# Altium project PROC010B.PrjPcb (part 5 of 5)

## Sheet PROC010B_CAN Interface.SchDoc: CAN Interface
size 431 x 279 mm; Date: Not shown in title block; ApprovedBy: Not shown in title block; CheckedBy: Not shown in title block; Author: Not shown in title block; CompanyName: Not shown in title block; DrawnBy: Adrian Ozer; Engineer: Not shown in title block; Organization: Not shown in title block; Address1: Not shown in title block; Address2: Not shown in title block; Address3: Not shown in title block; Address4: Not shown in title block; DocumentNumber: 14; Revision: Use project parameter SCH_Rev; SheetNumber: 14; SheetTotal: 16; PageSetup: Record=PageOptions|CenterHorizontal=True|CenterVertical=True|PrintScale=1.00|XCorrection=1.00|YCorrection=1.00|PrintKind=0|BorderSize=5000000|LeftOffset=0|BottomOffset=0|Orientation=2|PaperLength=1000|PaperWidth=1000|Scale=100|PaperSource=15|PrintQuality=600|MediaType=1|DitherType=10|PaperKind=Letter|PrintScaleMode=1; CurrentTime: Not shown in title block; CurrentDate: Not shown in title block; Time: Not shown in title block; DocumentFullPathAndName: Not shown in title block; DocumentName: Not shown in title block; ModifiedDate: Not shown in title block; ImagePath: Not shown in title block
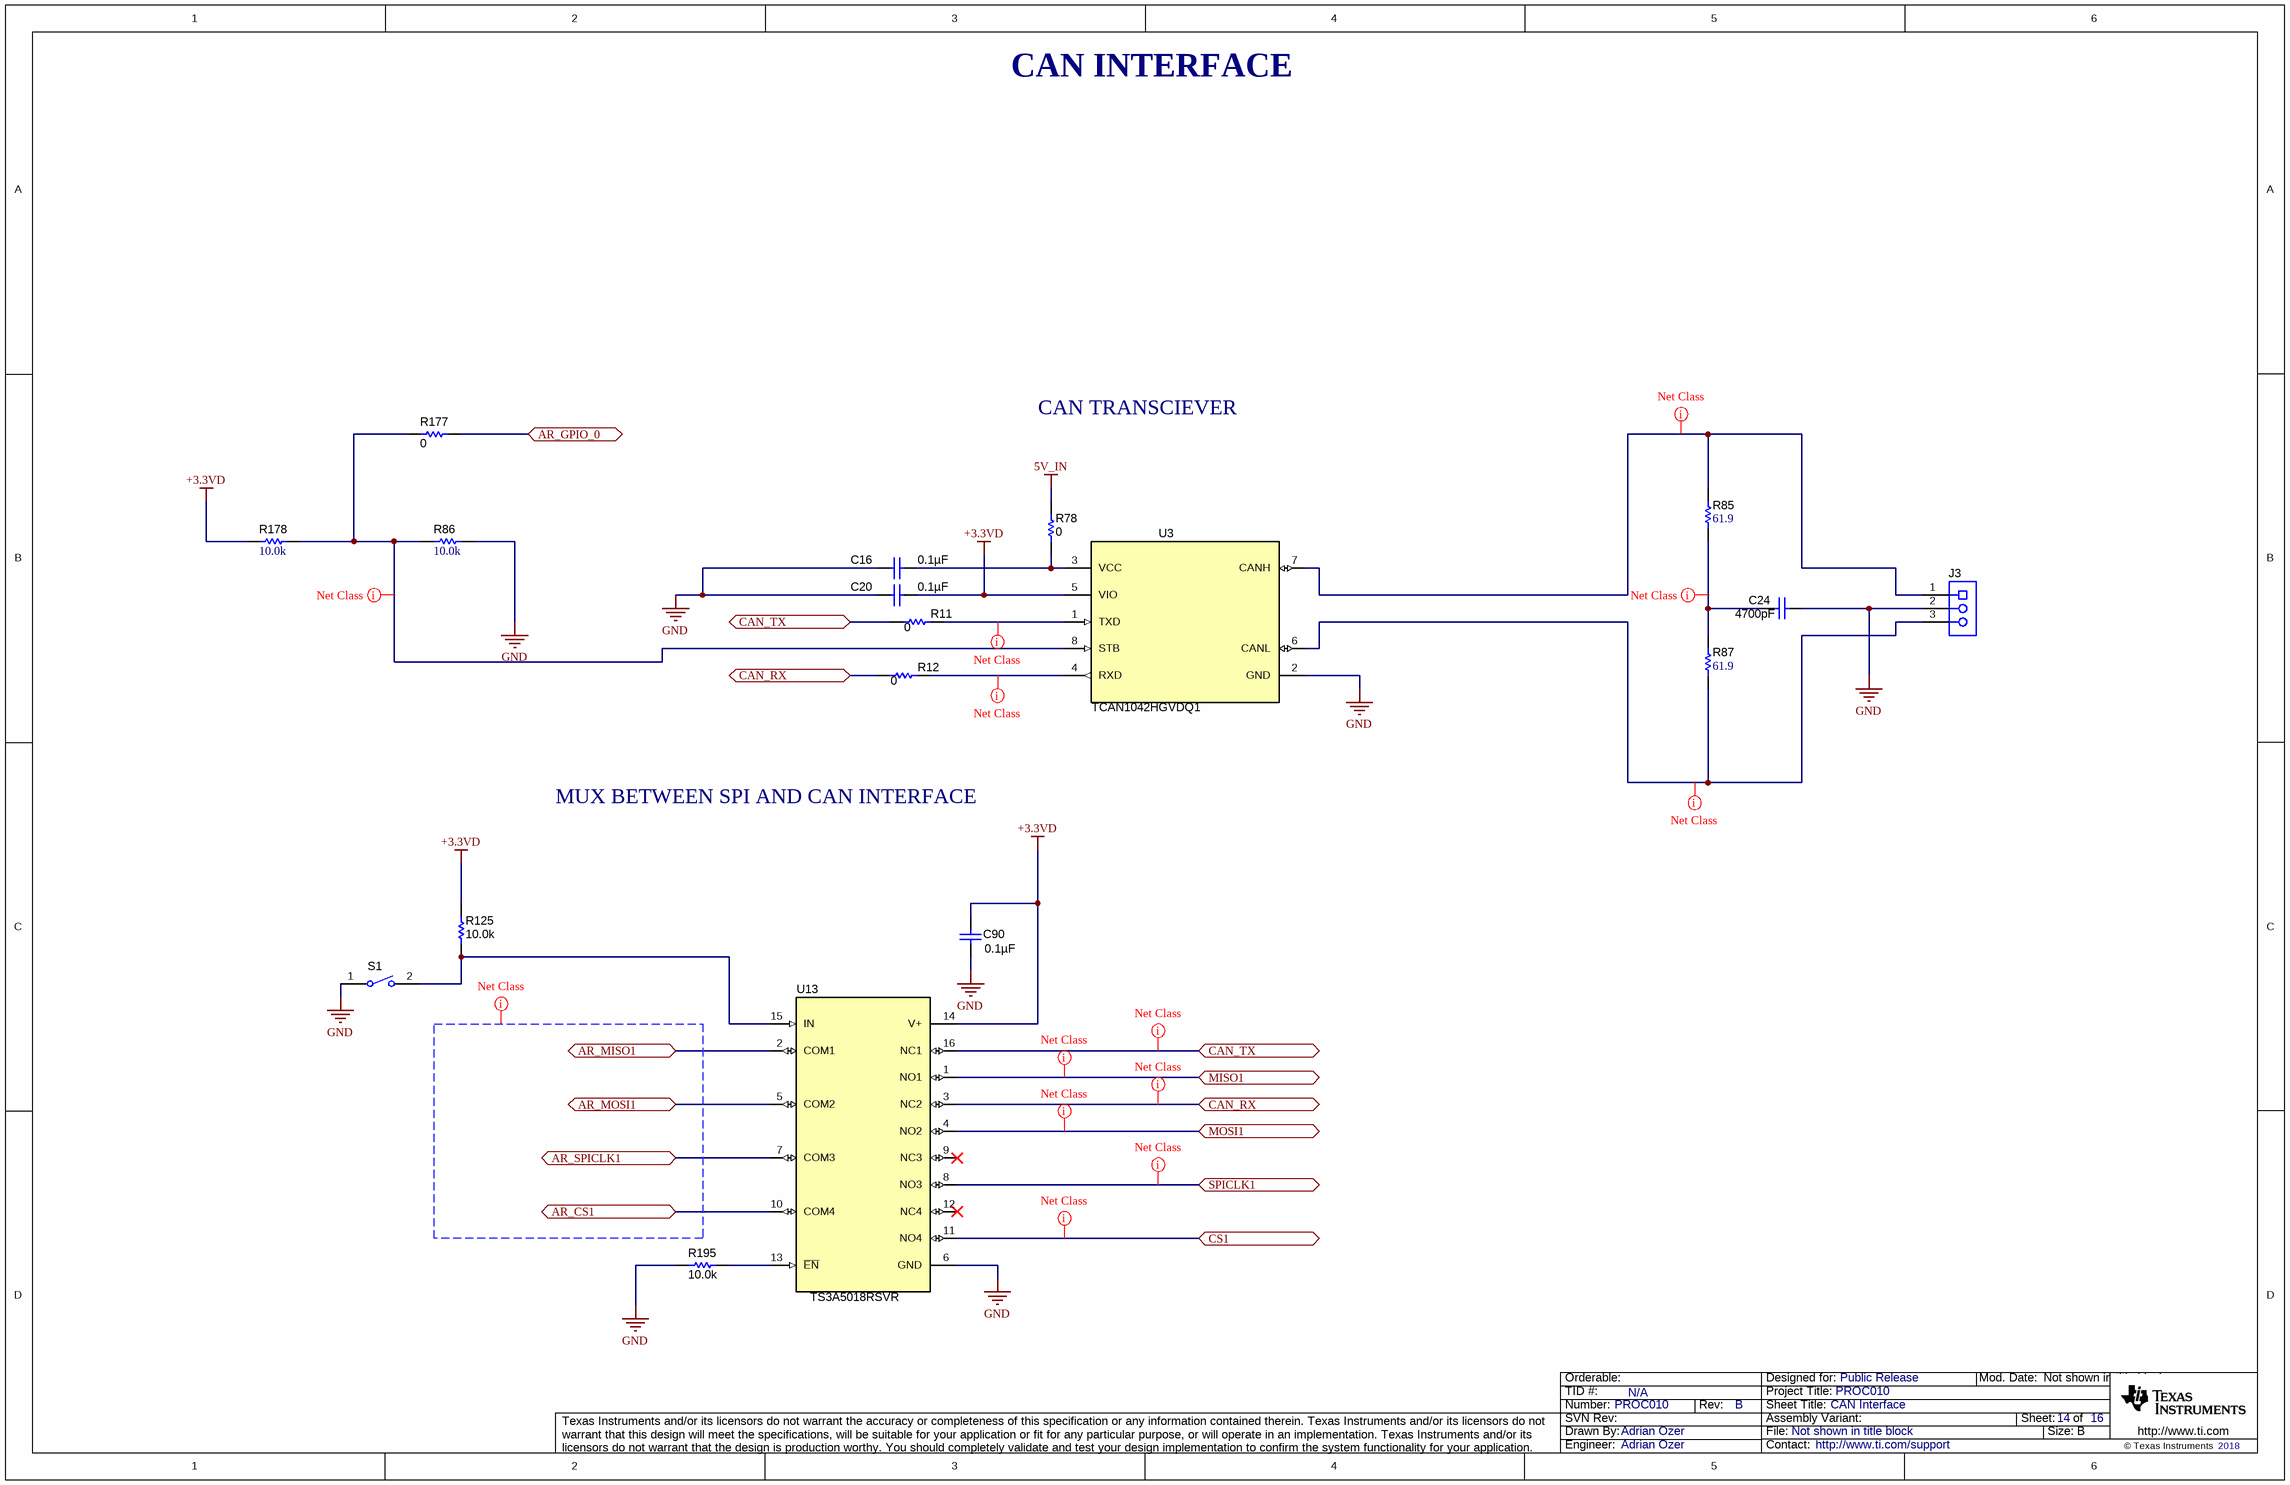
[diagram p13: PROC010B_CAN Interface.SchDoc]

### Parts
C16  ValueDisplayed: 0.1µF  [0402L]  (hidden comment: C0402C104K8RACTU)
C20  ValueDisplayed: 0.1µF  [0402L]  (hidden comment: C0402C104K8RACTU)
C24  ValueDisplayed: 4700pF  [0402L]  (hidden comment: C1005X7R1H472K050BA)
C90  ValueDisplayed: 0.1µF  [0402L]  (hidden comment: C0402C104K8RACTU)
J3  OSTTE030161  [On-Shore_OSTTE030161]  (value not drawn)
R11  ValueDisplayed: 0  [0402L]  (hidden comment: ERJ-2GE0R00X)
R12  ValueDisplayed: 0  [0402L]  (hidden comment: ERJ-2GE0R00X)
R78  ValueDisplayed: 0  [0402L]  (hidden comment: ERJ-2GE0R00X)
R85  ValueDisplayed: 61.9  [0402L]  (hidden comment: CRCW040261R9FKED)
R86  ValueDisplayed: 10.0k  [0402L]  (hidden comment: CRCW040210K0FKED)
R87  ValueDisplayed: 61.9  [0402L]  (hidden comment: CRCW040261R9FKED)
R125  ValueDisplayed: 10.0k  [0402L]  (hidden comment: CRCW040210K0FKED)
R177  ValueDisplayed: 0  [0402L]  (hidden comment: ERJ-2GE0R00X)
R178  ValueDisplayed: 10.0k  [0402L]  (hidden comment: CRCW040210K0FKED)
R195  ValueDisplayed: 10.0k  [0402L]  (hidden comment: CRCW040210K0FKED)
S1  CHS-01TB  [SW_CHS-01TB]  (value not drawn)
U3  TCAN1042HGVDQ1  [D0008A_L]
U13  TS3A5018RSVR  [RSV0016A]

### Ports
AR_CS1, AR_GPIO_0, AR_MISO1, AR_MOSI1, AR_SPICLK1, CAN_RX, CAN_TX, CS1, MISO1, MOSI1, SPICLK1

### Nets
5V_IN: R78.2
+3.3VD: C20.2 C90.2 R125.2 R178.1 U3.5(VIO) U13.14(V+)
GND: C16.1 C20.1 C24.1 C90.1 J3.2 R86.2 R195.2 S1.1 U3.2(GND) U13.6(GND)
AR_CS1: U13.10(COM4) ; port AR_CS1
AR_GPIO_0: R177.2 ; port AR_GPIO_0
AR_MISO1: U13.2(COM1) ; port AR_MISO1
AR_MOSI1: U13.5(COM2) ; port AR_MOSI1
AR_SPICLK1: U13.7(COM3) ; port AR_SPICLK1
CAN_RX: R12.1 U13.3(NC2) ; port CAN_RX
CAN_TX: R11.1 U13.16(NC1) ; port CAN_TX
CS1: U13.11(NO4) ; port CS1
MISO1: U13.1(NO1) ; port MISO1
MOSI1: U13.4(NO2) ; port MOSI1
SPICLK1: U13.8(NO3) ; port SPICLK1
NetC16_2: C16.2 R78.1 U3.3(VCC)
NetC24_2: C24.2 R85.1 R87.2
NetJ3_1: J3.1 R85.2 U3.7(CANH)
NetJ3_3: J3.3 R87.1 U3.6(CANL)
NetR11_2: R11.2 U3.1(TXD)
NetR12_2: R12.2 U3.4(RXD)
NetR86_1: R86.1 R177.1 R178.2 U3.8(STB)
NetR125_1: R125.1 S1.2 U13.15(IN)
NetR195_1: R195.1 U13.13(~{EN})

Not connected (* = marked no-connect by the designer): U13 9(NC3)* 12(NC4)*

### Layout directives
net class CAN: CAN_RX, CAN_TX, NetC24_2, NetJ3_1, NetJ3_3, NetR11_2, NetR12_2
net class GENERAL: NetR86_1
net class SPI: (no net found under the mark), CS1, MISO1, MOSI1, SPICLK1

### Notes on the sheet
- CAN INTERFACE
- CAN TRANSCIEVER
- MUX BETWEEN SPI AND CAN INTERFACE
- Drawn By:
- SVN Rev:
- Number:
- TID #:
- Orderable:
- Rev:
- Sheet Title:
- File:
- Project Title:
- Designed for:
- Assembly Variant:
- Mod. Date:
- Sheet:
- Size:
- of
- B
- http://www.ti.com
- Texas Instruments and/or its licensors do not warrant the accuracy or completeness of this specification or any information contained therein. Texas Instruments and/or its licensors do not warrant that this design will meet the specifications, will be suitable for your application or fit for any particular purpose, or will operate in an implementation. Texas Instruments and/or its licensors do not warrant that the design is production worthy. You should completely validate and test your design implementation to confirm the system functionality for your application.
- Engineer:
- Contact:
- © Texas Instruments

### Library data of the parts
C16 C20 C90 = CMP-0078241-1: CAP, CERM, 0.1 µF, 10 V,+/- 10%, X7R, 0402; Manufacturer: Kemet; TaMin_C: -55°C; Polarized: N; SizeAreaWB_mm2: 3; U/M: EA; Value: 0.1uF; TaMax_C: 125°C; SizeZ_mm: 0.6; SizeX_mm: 1; SizeY_mm: 0.5; Cap_Case: 0402; Value2: 10V; Cap_F: 100nF; AEC Category: Q200; ComponentLink1URL: https://content.kemet.com/datasheets/KEM_C1002_X7R_SMD.pdf; Supplier Part Number 2: 68X2393; Supplier 2: Newark; Supplier Part Number 3: 80-C0402C104K8R; TempCo: X7R; Supplier 3: Mouser; RoHS: Y; MountType: SMT; Supplier 1: Digi-Key; PackageReference: 0402; Tolerance_%: 10%; SizeArea_mm2: 0.5; CompType: Capacitor; PartNumber: C0402C104K8RACTU; AEC Qualified: N; VDC_V: 10V; ComponentLink1Description: Datasheet link; AEC Grade: N/A; Supplier Part Number 1: 399-3520-1-ND; Technology: Ceramic
C24 = CMP-0078221-1: CAP, CERM, 4700 pF, 50 V,+/- 10%, X7R, 0402; Manufacturer: TDK; TaMin_C: -55°C; Polarized: N; SizeAreaWB_mm2: 3; U/M: EA; Value: 4700pF; TaMax_C: 125°C; SizeZ_mm: 0.6; SizeX_mm: 1; SizeY_mm: 0.5; Cap_Case: 0402; Value2: 50V; Cap_F: 4.7nF; AEC Category: Q200; ComponentLink1URL: https://product.tdk.com/info/en/catalog/datasheets/mlcc_commercial_general_en.pdf; Supplier Part Number 2: 55T0075; Supplier 2: Newark; Supplier Part Number 3: 810-C1005X7R1H472K; TempCo: X7R; Supplier 3: Mouser; RoHS: Y; MountType: SMT; Supplier 1: Digi-Key; PackageReference: 0402; Tolerance_%: 10%; SizeArea_mm2: 0.5; CompType: Capacitor; PartNumber: C1005X7R1H472K050BA; AEC Qualified: N; VDC_V: 50V; ComponentLink1Description: Datasheet link; AEC Grade: N/A; Supplier Part Number 1: 445-1258-1-ND; Technology: Ceramic
J3 = CMP-0075352-1: Terminal Block, 3.5mm, 3x1, Tin, R/A, TH; Manufacturer: On-Shore Technology; CNHeader: False; Current_A: 10A; Green_Lifecycle: Not Set; Gender: Female; Cert_CSA: Y; Green_REACh: Incomplete; Voltage_V: 125V; Row_Count: 1; Pitch_mm: 3.5; CT: True; ComponentLink1URL: http://www.on-shore.com/wp-content/uploads/2015/09/osttexx0161.pdf; Publisher: Texas Instruments; Color: Blue; RoHS: Y; MountType: TH; Green_EU RoHS-2: Incomplete; Supplier 1: Digi-Key; Green_EU RoHS: Incomplete; PackageReference: Terminal Block, 3.5mm, 3x1, TH; PinCount: 3; CompType: Terminal Block; LatestRevisionDate: 2017-07-12; PartNumber: OSTTE030161; Orientation: R/A; ComponentLink1Description: Datasheet URL; Supplier Part Number 1: ED2636-ND; ContactFinish: Tin; Cert_UL: Y
R11 R12 R177 = CMP-0026992-2: RES, 0, 5%, 0.063 W, 0402; Manufacturer: Panasonic; Power_W: 63mW; TempCo: 600 ppm/C; Value_Code: 0000; U/M: EA; Value: 0; EIA_Code: E24; SizeX_mm: 1; SizeY_mm: 0.5; SizeZ_mm: 0.6; Value2: 0.063W; CompType: Resistor; VDC_V: 50V; AEC Category: Q200; INSTALATION: DNP; Supplier Part Number 2: 65T8307; Publisher: Texas Instruments; Supplier 2: Newark; Supplier Part Number 3: 667-ERJ-2GE0R00X; Supplier 3: Mouser; Published: 2008-06-26; RoHS: Y; Value1: 5%; MountType: SMT; Supplier 1: Digi-Key; PackageReference: 0402; Tolerance_%: 5%; Res_ohm: 0; SizeArea_mm2: 0.5; LatestRevisionDate: 2017-03-09; PartNumber: ERJ-2GE0R00X; AEC Qualified: ?; ComponentLink1Description: Datasheet link; Supplier Part Number 1: P0.0JCT-ND; Technology: Thick Film; ComponentLink1URL: http://www.panasonic.com/industrial/components/pdf/AOA0000CE1.pdf
R78 = CMP-0026992-2: RES, 0, 5%, 0.063 W, 0402; Manufacturer: Panasonic; Power_W: 63mW; TempCo: 600 ppm/C; Value_Code: 0000; U/M: EA; Value: 0; EIA_Code: E24; SizeX_mm: 1; SizeY_mm: 0.5; SizeZ_mm: 0.6; Value2: 0.063W; CompType: Resistor; VDC_V: 50V; AEC Category: Q200; Supplier Part Number 2: 65T8307; Publisher: Texas Instruments; Supplier 2: Newark; Supplier Part Number 3: 667-ERJ-2GE0R00X; Supplier 3: Mouser; Published: 2008-06-26; RoHS: Y; Value1: 5%; MountType: SMT; Supplier 1: Digi-Key; PackageReference: 0402; Tolerance_%: 5%; Res_ohm: 0; SizeArea_mm2: 0.5; LatestRevisionDate: 2017-03-09; PartNumber: ERJ-2GE0R00X; AEC Qualified: ?; ComponentLink1Description: Datasheet link; Supplier Part Number 1: P0.0JCT-ND; Technology: Thick Film; ComponentLink1URL: http://www.panasonic.com/industrial/components/pdf/AOA0000CE1.pdf
R85 R87 = CMP-0026491-2: RES, 61.9, 1%, 0.063 W, AEC-Q200 Grade 0, 0402; Manufacturer: Vishay-Dale; Power_W: 63mW; TempCo: 100 ppm/C; Value_Code: 61R9; Value: 61.9; EIA_Code: E96; SizeX_mm: 1; SizeY_mm: 0.5; SizeZ_mm: 0.6; Value2: 0.063W; AEC Qualified: Y; VDC_V: 50V; AEC Category: Q200; AEC Grade: 0; ComponentLink1URL: http://www.vishay.com/docs/20035/dcrcwe3.pdf; Supplier Part Number 2: 52K7198; Supplier 2: Newark; Supplier Part Number 3: 71-CRCW0402-61.9-E3; Supplier 3: Mouser; RoHS: E; Value1: 1%; MountType: SMT; Supplier 1: Digi-Key; PackageReference: 0402; Tolerance_%: 1%; Res_ohm: 61.9; SizeArea_mm2: 0.5; CompType: Resistor; PartNumber: CRCW040261R9FKED; ComponentLink1Description: Datasheet link; Supplier Part Number 1: 541-61.9LCT-ND; Technology: Thick Film
R86 R178 = CMP-0025958-3: RES, 10.0 k, 1%, 0.063 W, AEC-Q200 Grade 0, 0402; Manufacturer: Vishay-Dale; Power_W: 63mW; TempCo: 100 ppm/C; Value_Code: 10k0; Value: 10.0k; EIA_Code: E96; Res_ohm: 10k; SizeX_mm: 1; SizeY_mm: 0.5; SizeZ_mm: 0.6; Value2: 0.063W; AEC Qualified: Y; VDC_V: 50V; AEC Category: Q200; AEC Grade: 0; Supplier Part Number 2: 52K6595; Supplier 2: Newark; Supplier Part Number 3: 71-CRCW0402-10K-E3; Supplier 3: Mouser; RoHS: E; Value1: 1%; MountType: SMT; Supplier 1: Digi-Key; PackageReference: 0402; Tolerance_%: 1%; SizeArea_mm2: 0.5; CompType: Resistor; PartNumber: CRCW040210K0FKED; ComponentLink1Description: Datasheet link; Supplier Part Number 1: 541-10.0KLCT-ND; Technology: Thick Film; ComponentLink1URL: http://www.vishay.com/docs/20035/dcrcwe3.pdf
R125 R195 = CMP-0025958-2: RES, 10.0 k, 1%, 0.063 W, 0402; Manufacturer: Vishay-Dale; Power_W: 63mW; TempCo: 100 ppm/C; Value_Code: 10k0; U/M: EA; Value: 10.0k; EIA_Code: E96; Res_ohm: 10k; SizeX_mm: 1; SizeY_mm: 0.5; SizeZ_mm: 0.6; Value2: 0.063W; CompType: Resistor; VDC_V: 50V; AEC Category: Q200; Supplier Part Number 2: 52K6595; Publisher: Texas Instruments; Supplier 2: Newark; Supplier Part Number 3: 71-CRCW0402-10K-E3; Supplier 3: Mouser; Published: 2008-06-26; RoHS: Y; Value1: 1%; MountType: SMT; Supplier 1: Digi-Key; PackageReference: 0402; Tolerance_%: 1%; SizeArea_mm2: 0.5; LatestRevisionDate: 2017-03-09; PartNumber: CRCW040210K0FKED; AEC Qualified: ?; ComponentLink1Description: Datasheet link; Supplier Part Number 1: 541-10.0KLCT-ND; Technology: Thick Film; ComponentLink1URL: http://www.vishay.com/docs/20035/dcrcwe3.pdf
S1 = CMP-0002163-2: Switch, Slide, SPST, Top Slide, SMT; Manufacturer: Copal Electronics; CurrentRating_mA: 100A; SwitchFunction: Off-On; VDC_V: 6V; PositionCount: 1; ComponentLink1Description: Datasheet URL; LatestRevisionDate: 2017-03-09; PackageReference: Switch, Single Top Slide, 2.5x8x2.5mm; Publisher: Texas Instruments; Supplier 1: Digi-Key; Supplier Part Number 1: 563-1004-1-ND; MountType: SMT; Circuit: SPST; Orientation: Top Actuated; PartNumber: CHS-01TB; CompType: Switch; RoHS: Y; ComponentLink1URL: http://copal-electronics.info/en/CopalElectronics/switches_en/chs_en.pdf
U3 = CMP-0075992-1: Automotive Fault Protected CAN Transceiver With Flexible Data-Rate, D0008A (SOIC-8); Manufacturer: Texas Instruments; Alternate PartNumber: TCAN1042HGVDRQ1; SizeAreaWB_mm2: 56.58; SizeArea_mm2: 30.38; SizeZ_mm: 1.75; SizeY_mm: 6.2; U/M: EA; CompType: IC; SizeX_mm: 4.9; ComponentLink1Description: Datasheet Link; RoHS: Y; PackageReference: D0008A; PartNumber: TCAN1042HGVDQ1; Publisher: Texas Instruments; PackageDescription: SOIC-8; Alternate Manufacturer: Texas Instruments; ComponentLink1URL: http://www.ti.com/lit/ds/symlink/tcan1042-q1.pdf; LatestRevisionDate: 2017-06-09; MountType: SMT
U13 = CMP-0067415-1: 10-Ohm Quad SPDT Analog Switch, RSV0016A (UQFN-16); Alternate Manufacturer: Texas Instruments; SizeAreaWB_mm2: 10.08; U/M: EA; SizeZ_mm: 0.55; SizeX_mm: 1.8; SizeY_mm: 2.6; SizeArea_mm2: 4.68; CompType: IC; ComponentLink1URL: http://www.ti.com/lit/ds/symlink/ts3a5018.pdf; Publisher: Texas Instruments; PackageDescription: UQFN-16; RoHS: Y; Footprint Path 6: C:\AltiumLibraries\Footprints\TI\.PcbLib; MountType: SMT; Manufacturer: Texas Instruments; PackageReference: RSV0016A; LatestRevisionDate: 2017-06-09; PartNumber: TS3A5018RSVR; ComponentLink1Description: Datasheet Link

## Sheet PROC010B_Tempsensor.SchDoc: Tempsensor
size 431 x 279 mm; Date: Not shown in title block; ApprovedBy: Not shown in title block; CheckedBy: Not shown in title block; Author: Not shown in title block; CompanyName: Not shown in title block; DrawnBy: Adrian Ozer; Engineer: Not shown in title block; Organization: Not shown in title block; Address1: Not shown in title block; Address2: Not shown in title block; Address3: Not shown in title block; Address4: Not shown in title block; DocumentNumber: 15; Revision: Use project parameter SCH_Rev; SheetNumber: 15; SheetTotal: 16; PageSetup: Record=PageOptions|CenterHorizontal=True|CenterVertical=True|PrintScale=1.00|XCorrection=1.00|YCorrection=1.00|PrintKind=0|BorderSize=5000000|LeftOffset=0|BottomOffset=0|Orientation=2|PaperLength=1000|PaperWidth=1000|Scale=100|PaperSource=15|PrintQuality=600|MediaType=1|DitherType=10|PaperKind=Letter|PrintScaleMode=1; CurrentTime: Not shown in title block; CurrentDate: Not shown in title block; Time: Not shown in title block; DocumentFullPathAndName: Not shown in title block; DocumentName: Not shown in title block; ModifiedDate: Not shown in title block; ImagePath: Not shown in title block
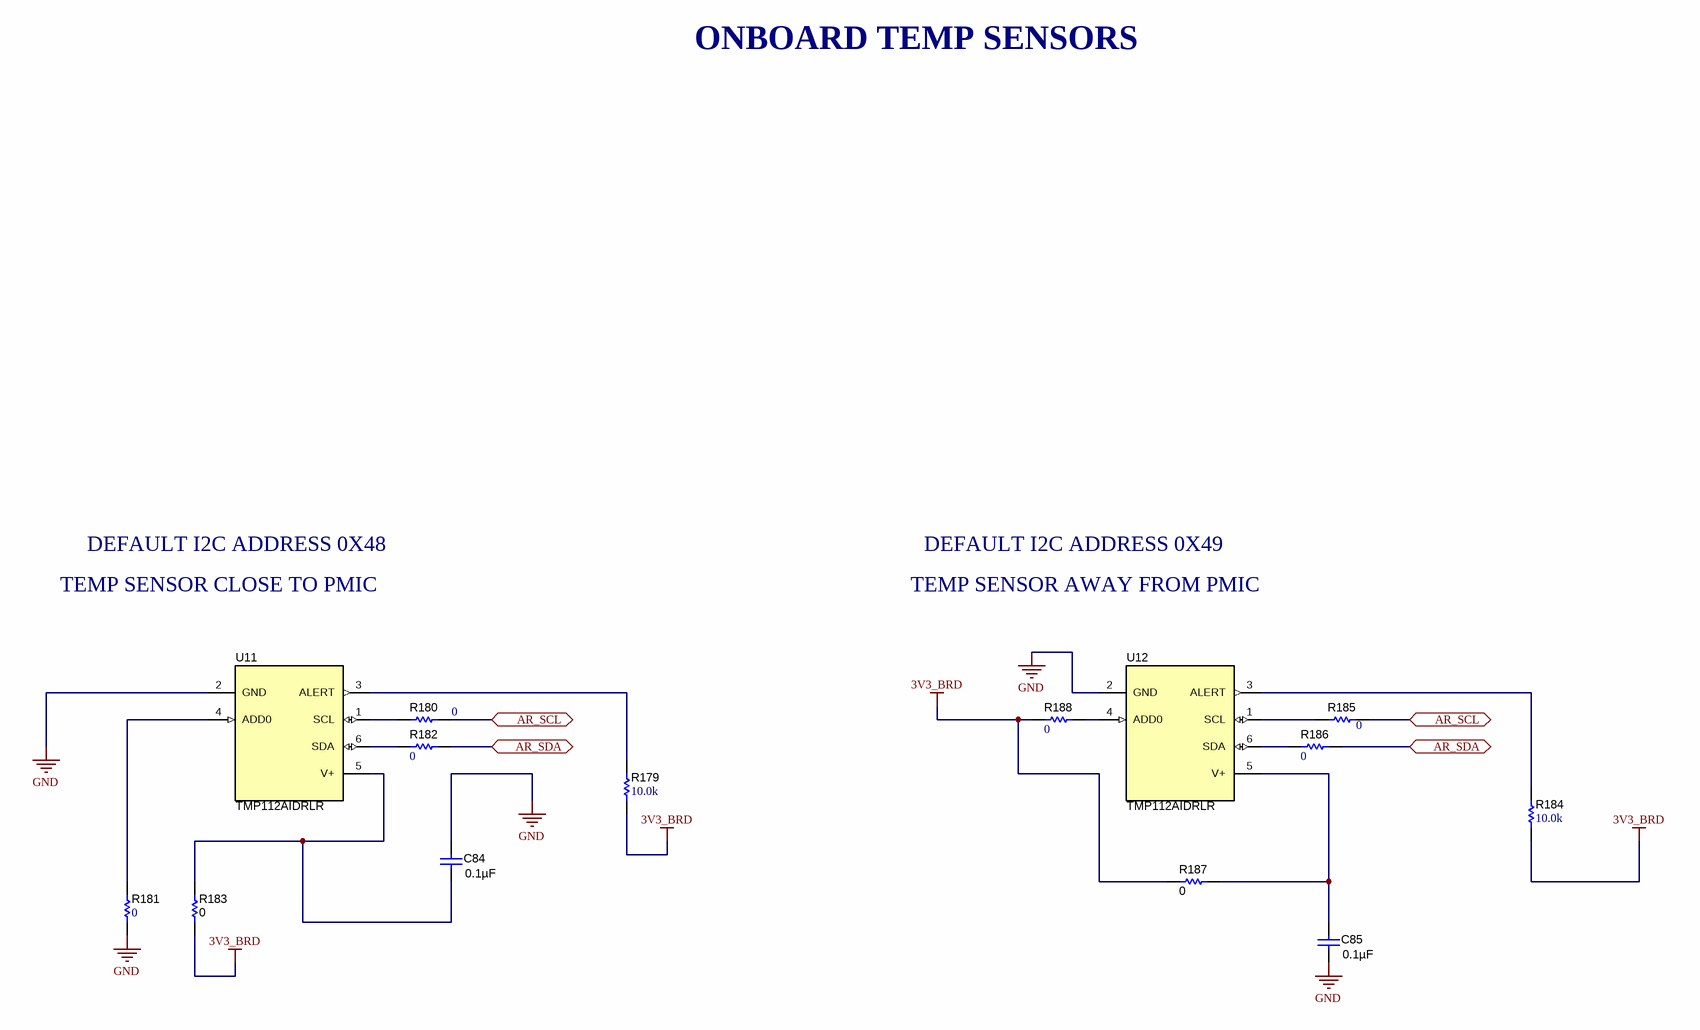
[diagram p14: PROC010B_Tempsensor.SchDoc]

### Parts
C84  ValueDisplayed: 0.1µF  [0402L]  (hidden comment: C0402C104K8RACTU)
C85  ValueDisplayed: 0.1µF  [0402L]  (hidden comment: C0402C104K8RACTU)
R179  ValueDisplayed: 10.0k  [0402L]  (hidden comment: CRCW040210K0FKED)
R180  ValueDisplayed: 0  [0201_Silk]  (hidden comment: CRCW02010000Z0ED)
R181  ValueDisplayed: 0  [0201_Silk]  (hidden comment: CRCW02010000Z0ED)
R182  ValueDisplayed: 0  [0201_Silk]  (hidden comment: CRCW02010000Z0ED)
R183  ValueDisplayed: 0  [0402L]  (hidden comment: ERJ-2GE0R00X)
R184  ValueDisplayed: 10.0k  [0402L]  (hidden comment: CRCW040210K0FKED)
R185  ValueDisplayed: 0  [0201_Silk]  (hidden comment: CRCW02010000Z0ED)
R186  ValueDisplayed: 0  [0201_Silk]  (hidden comment: CRCW02010000Z0ED)
R187  ValueDisplayed: 0  [0402L]  (hidden comment: ERJ-2GE0R00X)
R188  ValueDisplayed: 0  [0201_Silk]  (hidden comment: CRCW02010000Z0ED)
U11  TMP112AIDRLR  [DRL0006A]
U12  TMP112AIDRLR  [DRL0006A]

### Ports
AR_SCL, AR_SDA

### Nets
3V3_BRD: R179.2 R183.2 R184.2 R187.2 R188.1
GND: C84.1 C85.2 R181.2 U11.2(GND) U12.2(GND)
AR_SCL: R180.1 R185.1 ; port AR_SCL
AR_SDA: R182.2 R186.2 ; port AR_SDA
NetC84_2: C84.2 R183.1 U11.5(V+)
NetC85_1: C85.1 R187.1 U12.5(V+)
NetR179_1: R179.1 U11.3(ALERT)
NetR180_2: R180.2 U11.1(SCL)
NetR181_1: R181.1 U11.4(ADD0)
NetR182_1: R182.1 U11.6(SDA)
NetR184_1: R184.1 U12.3(ALERT)
NetR185_2: R185.2 U12.1(SCL)
NetR186_1: R186.1 U12.6(SDA)
NetR188_2: R188.2 U12.4(ADD0)

### Notes on the sheet
- ONBOARD TEMP SENSORS
- TEMP SENSOR CLOSE TO PMIC
- DEFAULT I2C ADDRESS 0X48
- TEMP SENSOR AWAY FROM PMIC
- DEFAULT I2C ADDRESS 0X49
- Drawn By:
- SVN Rev:
- Number:
- TID #:
- Orderable:
- Rev:
- Sheet Title:
- File:
- Project Title:
- Designed for:
- Assembly Variant:
- Mod. Date:
- Sheet:
- Size:
- of
- B
- http://www.ti.com
- Texas Instruments and/or its licensors do not warrant the accuracy or completeness of this specification or any information contained therein. Texas Instruments and/or its licensors do not warrant that this design will meet the specifications, will be suitable for your application or fit for any particular purpose, or will operate in an implementation. Texas Instruments and/or its licensors do not warrant that the design is production worthy. You should completely validate and test your design implementation to confirm the system functionality for your application.
- Engineer:
- Contact:
- © Texas Instruments

### Library data of the parts
C84 C85 = CMP-0078241-1: as C16 on sheet PROC010B_CAN Interface; ComponentLink1URL: https://content.kemet.com/datasheets/KEM_C1002_X7R_SMD.pdf; Supplier Part Number 2: 68X2393; Supplier 2: Newark; Supplier Part Number 3: 80-C0402C104K8R; TempCo: X7R; Supplier 3: Mouser; RoHS: Y; MountType: SMT; Supplier 1: Digi-Key; PackageReference: 0402; Tolerance_%: 10%; SizeArea_mm2: 0.5; CompType: Capacitor; PartNumber: C0402C104K8RACTU; AEC Qualified: N; VDC_V: 10V; ComponentLink1Description: Datasheet link; AEC Grade: N/A; Supplier Part Number 1: 399-3520-1-ND; Technology: Ceramic
R179 R184 = CMP-0025958-3: as R86 on sheet PROC010B_CAN Interface; Supplier Part Number 2: 52K6595; Supplier 2: Newark; Supplier Part Number 3: 71-CRCW0402-10K-E3; Supplier 3: Mouser; RoHS: E; Value1: 1%; MountType: SMT; Supplier 1: Digi-Key; PackageReference: 0402; Tolerance_%: 1%; SizeArea_mm2: 0.5; CompType: Resistor; PartNumber: CRCW040210K0FKED; ComponentLink1Description: Datasheet link; Supplier Part Number 1: 541-10.0KLCT-ND; Technology: Thick Film; ComponentLink1URL: http://www.vishay.com/docs/20035/dcrcwe3.pdf
R180-R182 R185 R186 R188 = CMP-0027008-4: RES, 0, 5%, 0.05 W, 0201; Manufacturer: Vishay-Dale; Power_W: 50mW; TempCo: ppm/C; Value_Code: 0000; Value: 0; EIA_Code: E24; SizeX_mm: 0.6; SizeY_mm: 0.3; SizeZ_mm: 0.26; Value2: 0.05W; SizeArea_mm2: 0.18; AEC Qualified: N; AEC Category: Q200; RoHS: E; Value1: 5%; MountType: SMT; Supplier 1: Newark; PackageReference: 0201; Tolerance_%: 5%; Res_ohm: 0; CompType: Resistor; PartNumber: CRCW02010000Z0ED; ComponentLink1Description: Datasheet link; AEC Grade: N/A; Supplier Part Number 1: 72M6743; Technology: Thick Film; ComponentLink1URL: http://www.vishay.com/docs/20052/crcw0201e3.pdf
R183 R187 = CMP-0026992-2: RES, 0, 5%, 0.063 W, 0402; Manufacturer: Panasonic; Power_W: 63mW; TempCo: 600 ppm/C; Value_Code: 0000; U/M: EA; Value: 0; EIA_Code: E24; SizeX_mm: 1; SizeY_mm: 0.5; SizeZ_mm: 0.6; Value2: 0.063W; VDC_V: 50V; AEC Category: Q200; Supplier Part Number 2: 65T8307; Publisher: Texas Instruments; Supplier 2: Newark; Supplier Part Number 3: 667-ERJ-2GE0R00X; Supplier 3: Mouser; Published: 2008-06-26; RoHS: Y; Value1: 5%; MountType: SMT; Supplier 1: Digi-Key; PackageReference: 0402; Tolerance_%: 5%; Res_ohm: 0; SizeArea_mm2: 0.5; CompType: Resistor; LatestRevisionDate: 2017-03-09; PartNumber: ERJ-2GE0R00X; AEC Qualified: ?; ComponentLink1Description: Datasheet link; Supplier Part Number 1: P0.0JCT-ND; Technology: Thick Film; ComponentLink1URL: http://www.panasonic.com/industrial/components/pdf/AOA0000CE1.pdf
U11 U12 = CMP-0067397-2: 1.4V-Capable +/-0.5degC Temperature Sensor with Alert Function and I2C/SMBus interface in SOT-563, DRL0006A (SOT-OTHER-6); Alternate PartNumber: TMP112AIDRLT; Alternate Manufacturer: Texas Instruments; Green_Lifecycle: Active; SizeAreaWB_mm2: 6.76; Green_REACh: Passed; U/M: EA; SizeZ_mm: 0.6; SizeX_mm: 1.6; SizeArea_mm2: 2.56; CompType: IC; ComponentLink1URL: http://www.ti.com/lit/ds/symlink/tmp112.pdf; Publisher: Texas Instruments; PackageDescription: SOT-OTHER-6; RoHS: Y; MountType: SMT; Green_EU RoHS-2: Passed; Manufacturer: Texas Instruments; Green_EU RoHS: Passed; PackageReference: DRL0006A; SizeY_mm: 1.6; LatestRevisionDate: 2017-06-09; PartNumber: TMP112AIDRLR; ComponentLink1Description: Datasheet Link

## Sheet PROC010B_Hardware.SchDoc: Hardware
size 431 x 279 mm; Date: Not shown in title block; ApprovedBy: Not shown in title block; CheckedBy: Not shown in title block; Author: Not shown in title block; CompanyName: Not shown in title block; DrawnBy: Adrian Ozer; Engineer: Not shown in title block; Organization: Not shown in title block; Address1: Not shown in title block; Address2: Not shown in title block; Address3: Not shown in title block; Address4: Not shown in title block; DocumentNumber: 16; Revision: Use project parameter SCH_Rev; SheetNumber: 16; SheetTotal: 16; PageSetup: Record=PageOptions|CenterHorizontal=True|CenterVertical=True|PrintScale=1.00|XCorrection=1.00|YCorrection=1.00|PrintKind=0|BorderSize=5000000|LeftOffset=0|BottomOffset=0|Orientation=2|PaperLength=1000|PaperWidth=1000|Scale=100|PaperSource=15|PrintQuality=600|MediaType=1|DitherType=10|PaperKind=Letter|PrintScaleMode=1; CurrentTime: Not shown in title block; CurrentDate: Not shown in title block; Time: Not shown in title block; DocumentFullPathAndName: Not shown in title block; DocumentName: Not shown in title block; ModifiedDate: Not shown in title block; ImagePath: Not shown in title block
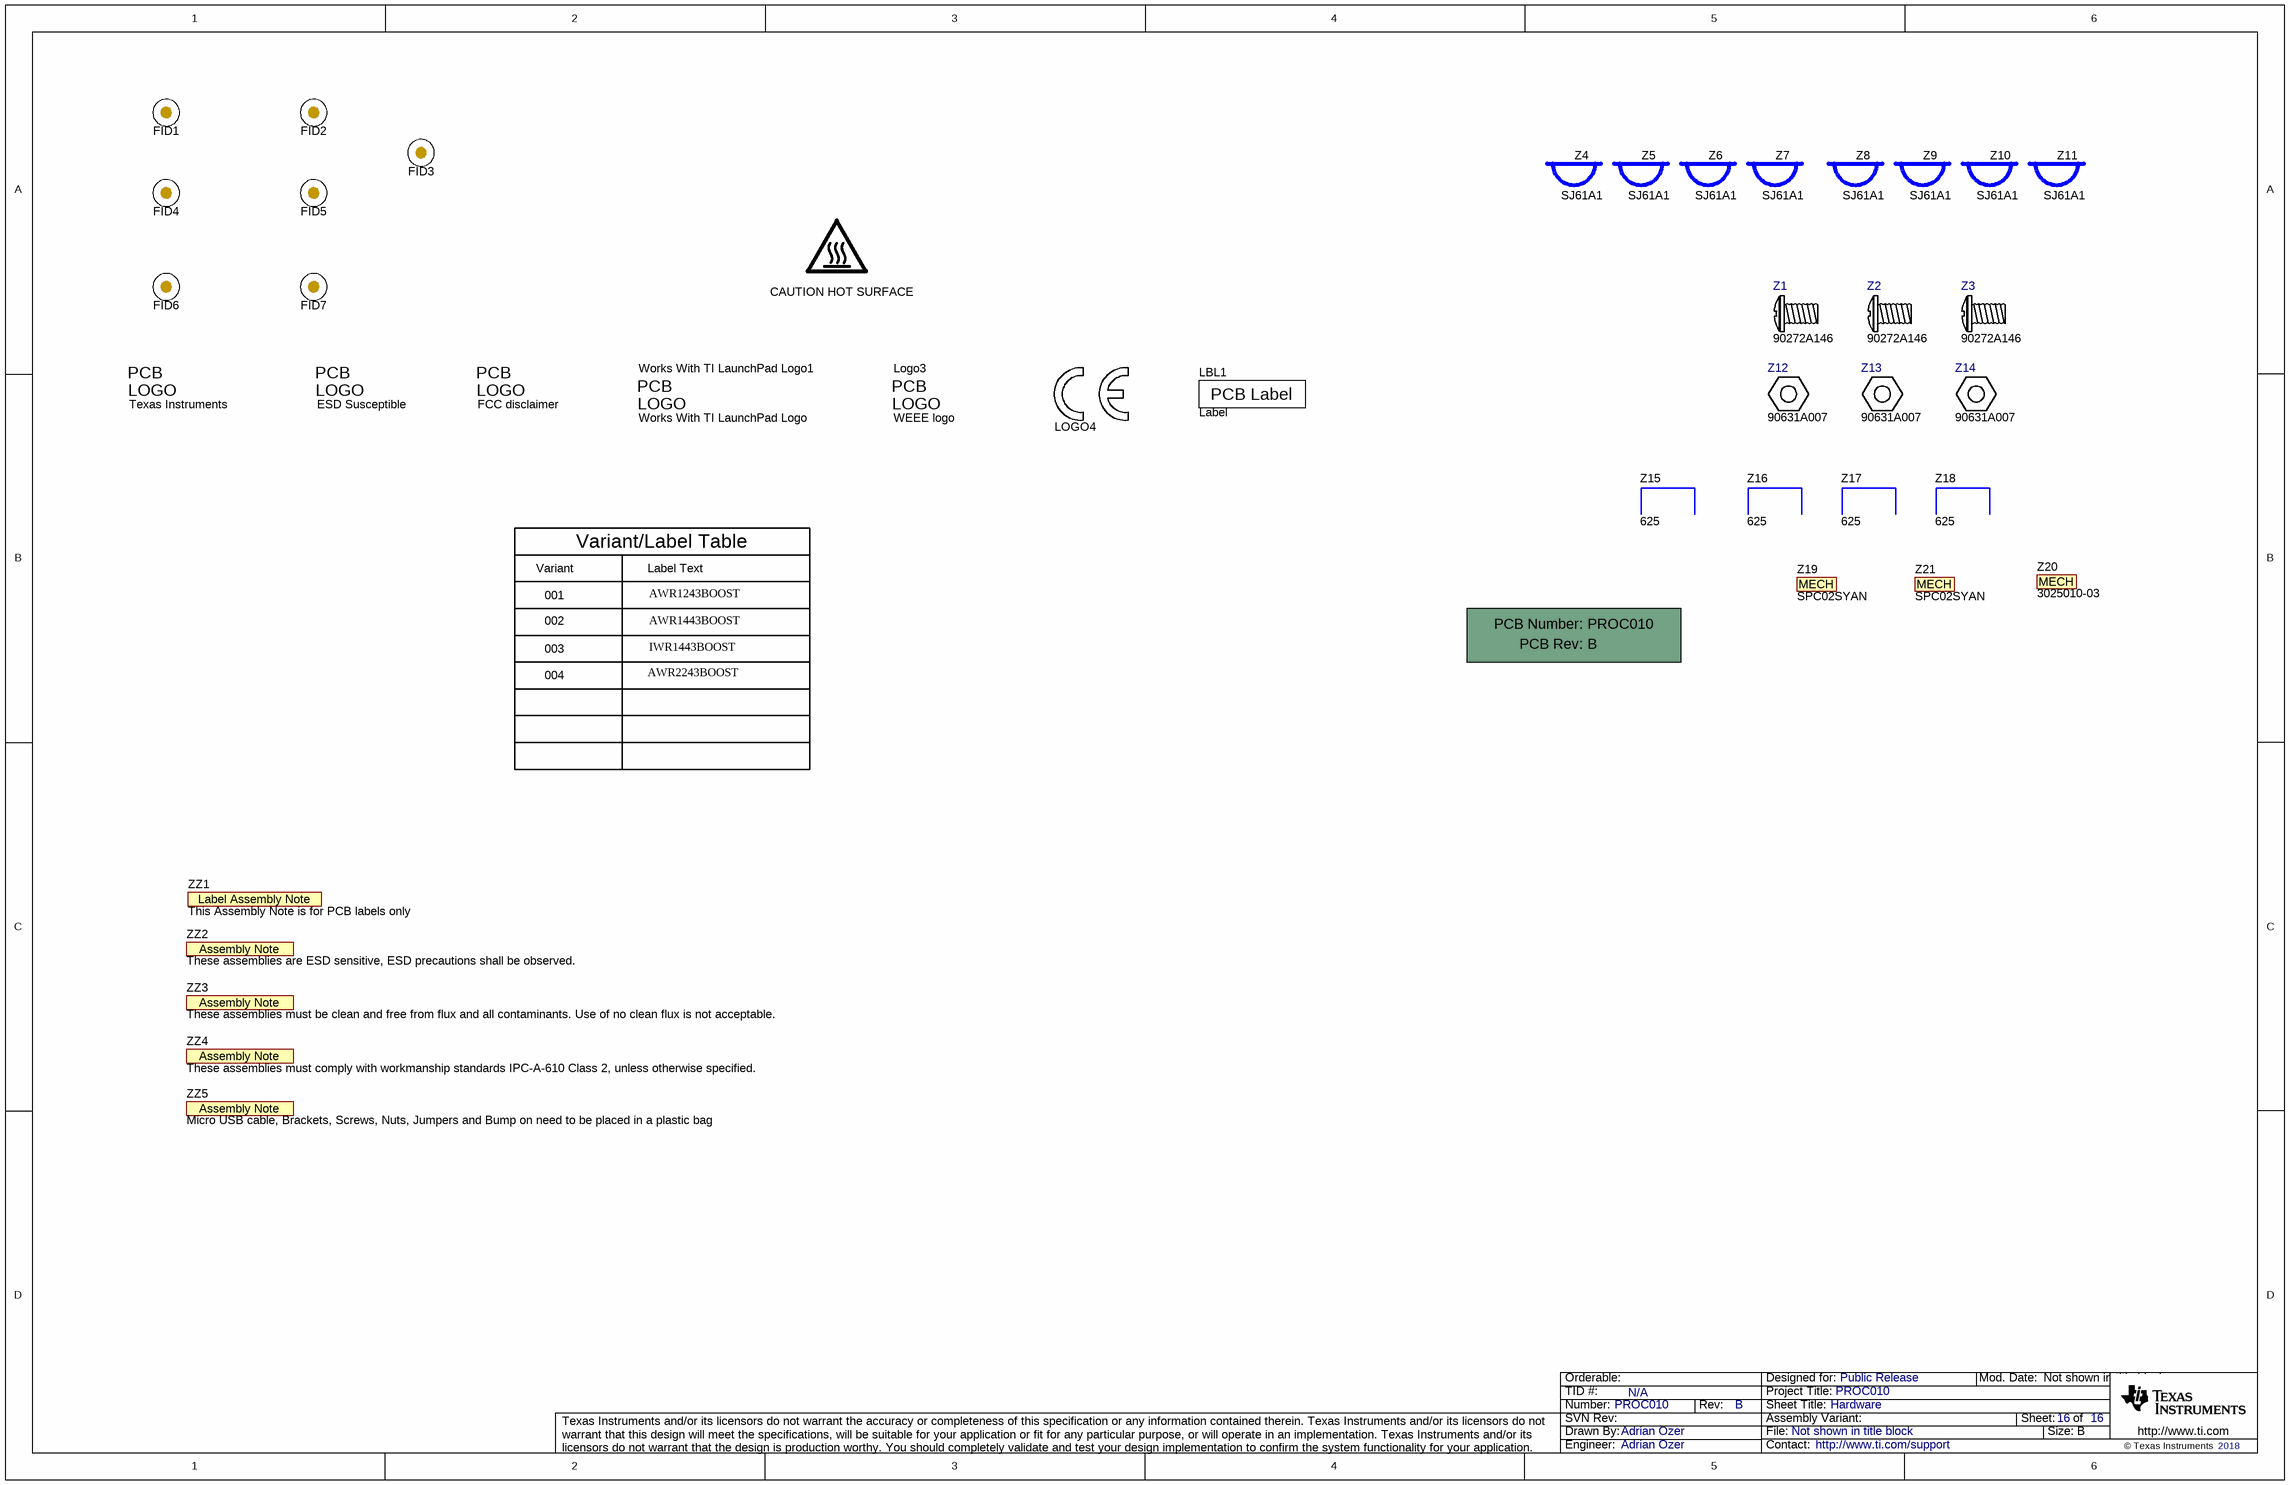
[diagram p15: PROC010B_Hardware.SchDoc]

### Parts
!PCB1  PROC010  (value not drawn)  (mechanical)
CAUTION_HOT_SURFACE1  CAUTION HOT SURFACE  [IEC_HotSurface_Small]  (no BOM)
ESD_Susceptible1  ESD Susceptible  [ESD_Overlay_Small]  (no BOM)
FID1  Fiducial  [Fiducial10-20]  (value not drawn)
FID2  Fiducial  [Fiducial10-20]  (value not drawn)
FID3  Fiducial  [Fiducial10-20]  (value not drawn)
FID4  Fiducial  [Fiducial10-20]  (value not drawn)
FID5  Fiducial  [Fiducial10-20]  (value not drawn)
FID6  Fiducial  [Fiducial10-20]  (value not drawn)
FID7  Fiducial  [Fiducial10-20]  (value not drawn)
LBL1  Label  [Label_650x200]
Logo1  Texas Instruments  [TI_Stacked_Overlay_Small]  (no BOM)
Logo2  FCC disclaimer  [FCC_disclaimer]  (no BOM)
Logo3  WEEE logo  [WEEE_Minimum]  (no BOM)
LOGO4  CE Mark  [CE_Mark_5mm]  (value not drawn)  (no BOM)
Works_With_TI_LaunchPad_Logo1  Works With TI LaunchPad Logo  [WorksWithTILaunchPad]  (no BOM)
Z1  90272A146  (mechanical)
Z2  90272A146  (mechanical)
Z3  90272A146  (mechanical)
Z4  SJ61A1  (mechanical)
Z5  SJ61A1  (mechanical)
Z6  SJ61A1  (mechanical)
Z7  SJ61A1  (mechanical)
Z8  SJ61A1  (mechanical)
Z9  SJ61A1  (mechanical)
Z10  SJ61A1  (mechanical)
Z11  SJ61A1  (mechanical)
Z12  90631A007  (mechanical)
Z13  90631A007  (mechanical)
Z14  90631A007  (mechanical)
Z15  625  (mechanical)
Z16  625  (mechanical)
Z17  625  (mechanical)
Z18  625  (mechanical)
Z19  SPC02SYAN  (mechanical)
Z20  3025010-03  (mechanical)
Z21  SPC02SYAN  (mechanical)
ZZ1  This Assembly Note is for PCB labels only  [AssemblyNoteLabel]  (no BOM)
ZZ2  These assemblies are ESD sensitive, ESD precautions shall be observed.  [AssemblyNote]  (no BOM)
ZZ3  These assemblies must be clean and free from flux and all contaminants. Use of no clean flux is not acceptable.  [AssemblyNote]  (no BOM)
ZZ4  These assemblies must comply with workmanship standards IPC-A-610 Class 2, unless otherwise specified.  [AssemblyNote]  (no BOM)
ZZ5  Micro USB cable, Brackets, Screws, Nuts, Jumpers and Bump on need to be placed in a plastic bag  [AssemblyNote]  (no BOM)

### Notes on the sheet
- Variant
- Variant/Label Table
- Label Text
- 001
- 002
- AWR1243BOOST
- AWR1443BOOST
- 003
- 004
- AWR2243BOOST
- IWR1443BOOST
- Drawn By:
- SVN Rev:
- Number:
- TID #:
- Orderable:
- Rev:
- Sheet Title:
- File:
- Project Title:
- Designed for:
- Assembly Variant:
- Mod. Date:
- Sheet:
- Size:
- of
- B
- http://www.ti.com
- Texas Instruments and/or its licensors do not warrant the accuracy or completeness of this specification or any information contained therein. Texas Instruments and/or its licensors do not warrant that this design will meet the specifications, will be suitable for your application or fit for any particular purpose, or will operate in an implementation. Texas Instruments and/or its licensors do not warrant that the design is production worthy. You should completely validate and test your design implementation to confirm the system functionality for your application.
- Engineer:
- Contact:
- © Texas Instruments
- (in symbol 0050579402) MECH
- (in symbol AK672M/2-1-R) MECH
- (in symbol CMP-0003616-3) Label Assembly Note
- (in symbol CMP-0003618-2) PCB Number:; PCB Rev:
- (in symbol CMP-0003625-1) PCB Label
- (in symbol CMP-0074769-1) PCB; LOGO
- (in symbol CMP-0074838-1) PCB; LOGO
- (in symbol CMP-0074840-1) PCB; LOGO
- (in symbol CMP-0074847-1) PCB; LOGO
- (in symbol CMP-0077108-1) PCB; LOGO
- (in symbol CMP-0077237-1) Assembly Note
- (in symbol CMP-0077238-1) Assembly Note

### Library data of the parts
!PCB1 = CMP-0003618-2: Printed Circuit Board; Manufacturer: Any; CompType: PCB; PartNumber: PROC010; RoHS: O; MountType: N/A; Publisher: Texas Instruments; LatestRevisionDate: 2017-03-09; Key: PCB
CAUTION_HOT_SURFACE1 = CMP-0074837-1: IEC 61010-1 Hot Surface Warning; Library Reference: IEC_HotSurface; SymbolCreator: a0412235; Publisher: Texas Instruments; SymbolVersion: 2011-08-22; Published: 2009-03-03; Lib Reference: IEC_HotSurface; LatestRevisionDate: 2017-07-06; PartNumber: CAUTION HOT SURFACE
ESD_Susceptible1 = CMP-0074840-1: ESD Susceptible Symbol; Library Reference: Logo; SymbolCreator: a0412235; Lib Reference: ESD_Susceptible; Publisher: Texas Instruments; SymbolVersion: 2011-08-22; Published: 2009-03-03; LatestRevisionDate: 2017-07-06; PartNumber: ESD Susceptible
FID1-FID7 = CMP-0077181-1: Fiducial mark.  There is nothing to buy or mount.; CompType: Fiducial; Manufacturer: N/A; MountType: N/A; PackageReference: N/A; PartNumber: N/A; ClassName: FiducialMark; Library Reference: Fiducial
LBL1 = CMP-0003625-1: Thermal Transfer Printable Labels, 0.650" W x 0.200" H - 10,000 per roll; Manufacturer: Brady; PartNumber: THT-14-423-10; Note: Size: 0.65" x 0.20 "; ClassName: Label; CompType: Label; RoHS: Y; PackageReference: PCB Label 0.650 x 0.200 inch; MountType: N/A; ComponentLink1Description: Web Page; ComponentLink1URL: http://www.bradyid.com/bradyid/pdpv/THT-14-423-10.html; Publisher: Texas Instruments; LatestRevisionDate: 2017-03-09; Supplier 1: Newark; Supplier Part Number 1: 97C5133; Supplier 2: Farnell; Supplier Part Number 2: 2065596; Key: THT-14-423-10
Logo1 = CMP-0074838-1: Texas Instrument Corporate Signature; SymbolCreator: a0412235; Lib Reference: TI_Logo; Library Reference: Logo; SymbolVersion: 2011-08-22; Published: 2009-03-03; Publisher: Texas Instruments; ClassName: Logo; LatestRevisionDate: 2017-07-06; PartNumber: Texas Instruments
Logo2 = CMP-0074847-1: FCC_disclaimer; Library Reference: Logo; Published: 2009-03-03; Publisher: Texas Instruments; LatestRevisionDate: 2017-07-06; Lib Reference: FCC_disclaimer; PartNumber: FCC disclaimer
Logo3 = CMP-0074769-1: Library Reference: WEEE logo; Lib Reference: WEEE logo; PartNumber: WEEE logo
LOGO4 = CMP-0074844-1: SymbolCreator: a0412235; Published: 2009-03-03; Publisher: Texas Instruments; LatestRevisionDate: 2017-07-06; Lib Reference: CE Mark; PartNumber: CE Mark; Library Reference: CE Mark
Works_With_TI_LaunchPad_Logo1 = CMP-0077108-1: Publisher: Texas Instruments; LatestRevisionDate: 2017-07-28; Lib Reference: Works With TI LaunchPad; Library Reference: Logo; Published: 2009-03-03
Z1-Z3 = NY PMS 256 0050 PH: Screw, Pan Philips, Steel, 6-32; Manufacturer: McMaster-Carr; SymbolCreator: a0412235; SymbolVersion: 2013-11-25; CompType: Screw; PartNumber: 90272A146; RoHS: Y; MountType: N/A; ComponentLink1Description: Datasheet Link; ComponentLink1URL: http://www.fasnetdirect.com/refguide/Nylpanms.pdf; Publisher: Texas Instruments; LatestRevisionDate: 2017-06-22; Supplier 1: Digi-Key
Z4-Z11 = SJ61A1: Bumpon, Cylindrical, 0.312 X 0.200, Black; Manufacturer: 3M; SymbolCreator: a0412235; Green_Lifecycle: Not Set; Green_REACh: Incomplete; SymbolVersion: 2012-03-04; CompType: Bumpon; PartNumber: SJ61A1; RoHS: Y; PackageReference: Black Bumpon; MountType: N/A; ComponentLink1Description: Datasheet Link; ComponentLink1URL: http://multimedia.3m.com/mws/mediawebserver?mwsId=66666UF6EVsSyXTtOxTXoxMtEVtQEVs6EVs6EVs6E666666--&fn=SJxxA1.pdf; Publisher: Texas Instruments; LatestRevisionDate: 2017-06-22; Supplier 1: Digi-Key; Supplier Part Number 1: SJ5746-0-ND; Supplier 2: Mouser; Supplier Part Number 2: 517-SJ-61A1; Green_EU RoHS: Incomplete; Green_EU RoHS-2: Incomplete
Z12-Z14 = HNSS 832: Nut, Hex, Steel Nylon-Insert, 6-32; Manufacturer: mcmaster; CompType: Nut; PartNumber: 90631A007; RoHS: Y
Z15-Z18 = PCC-SMP-CLIP: BRACKET MOUNTIG ALUM; Manufacturer: Keystone Electronics; CompType: Hardware; PartNumber: 625; RoHS: Y; PackageReference: Active; MountType: Bracket, Non-Threaded Hole(s; ComponentLink1URL: https://www.digikey.com/product-detail/en/keystone-electronics/625/36-625-ND/2745609; Supplier Part Number 1: Digi-Key
Z19 Z21 = 0050579402: 2 (1 x 2) Position Shunt Connector Black Closed Top 0.100" (2.54mm) Gold; PartNumber: SPC02SYAN; RoHS: Y; Publisher: Texas Instruments
Z20 = AK672M/2-1-R: CABLE MINI USB 5PIN 1M 2.0 VERS; CompType: CABLE USB; PartNumber: 3025010-03; RoHS: Y; Supplier 1: Digi-Key
ZZ1 = CMP-0003616-3: CompType: AssemblyNote; ClassName: AssemblyNote; Publisher: Texas Instruments; LatestRevisionDate: 2017-03-09; Key: AssemblyNoteLabel
ZZ2 = CMP-0077236-1: CompType: AssemblyNote; ClassName: AssemblyNote; Publisher: Texas Instruments; LatestRevisionDate: 2017-08-10; Key: AssemblyNote
ZZ3 = CMP-0077237-1: CompType: AssemblyNote; ClassName: AssemblyNote; Publisher: Texas Instruments; LatestRevisionDate: 2017-08-10; Key: AssemblyNote
ZZ4 = CMP-0077238-1: CompType: AssemblyNote; ClassName: AssemblyNote; Publisher: Texas Instruments; LatestRevisionDate: 2017-08-10; Key: AssemblyNote
ZZ5 = CMP-0077238-1: Micro USB cable, Brackets, Screws, Nuts, Jumpers and Bump on need to be placed in a platic bag; CompType: AssemblyNote; ClassName: AssemblyNote; Publisher: Texas Instruments; LatestRevisionDate: 2017-08-10; Key: AssemblyNote

## Nets that join several sheets
3V3_BRD: PROC010B_XDS110 Interface_1A (11 pins), PROC010B_XDS110 Interface_1B (20 pins), PROC010B_Tempsensor (5 pins)
5V_IN: PROC010B_PMIC_Reference (R149.2), PROC010B_Pwr_RST_LEDs (7 pins), PROC010B_HD Connector (R34.2), PROC010B_LP Connector (R115.2), PROC010B_XDS110 Interface_1A (R176.2), PROC010B_CAN Interface (R78.2)
5V_UNREG: PROC010B_PMIC_Reference (10 pins), PROC010B_Pwr_RST_LEDs (P5.2 R118.2)
+3.3VD: PROC010B_DUT_Reference (7 pins), PROC010B_Decoupling_Caps_Reference (C5.1), PROC010B_SOP_Headers_Reference (P2.2 P3.2 P4.2), PROC010B_QSPI_Flash_Reference (R37.1 R38.2 R41.2 R43.2), PROC010B_Pwr_RST_LEDs (6 pins), PROC010B_LP Connector (R172.2 R173.2), PROC010B_CAN Interface (6 pins)
AR_1P3_RF1: PROC010B_DUT_Reference (U2.G5 U2.H5 U2.J5), PROC010B_Decoupling_Caps_Reference (C45.1 C47.1), PROC010B_LC_Filtering_Reference (C36.2 C38.2 L5.2), PROC010B_LDO (5 pins)
AR_1P3_RF2: PROC010B_DUT_Reference (U2.C2 U2.D2), PROC010B_Decoupling_Caps_Reference (C57.1 C58.1), PROC010B_LC_Filtering_Reference (C33.2 C34.2 L8.2 R137.1), PROC010B_LDO (5 pins)
AR_1V2: PROC010B_DUT_Reference (6 pins), PROC010B_Decoupling_Caps_Reference (C3.1 C4.1 C6.1 C7.1), PROC010B_LC_Filtering_Reference (L9.2)
AR_1V4_APLL: PROC010B_DUT_Reference (U2.A10), PROC010B_Decoupling_Caps_Reference (C13.1)
AR_1V4_SYNTH: PROC010B_DUT_Reference (U2.A13), PROC010B_Decoupling_Caps_Reference (C14.1)
AR_1V8: PROC010B_DUT_Reference (6 pins), PROC010B_Decoupling_Caps_Reference (7 pins), PROC010B_LC_Filtering_Reference (C19.1 C91.2 L7.2), PROC010B_LDO (C18.1 R82.2 U4.1 U4.2)
AR_VBGAP: PROC010B_DUT_Reference (U2.B10), PROC010B_Decoupling_Caps_Reference (C56.1)
AR_VOUT_PA: PROC010B_DUT_Reference (U2.A2 U2.B2), PROC010B_Decoupling_Caps_Reference (C10.1 C65.1 C83.1), PROC010B_LC_Filtering_Reference (R137.2)
GND: PROC010B_DUT_Reference (81 pins), PROC010B_Decoupling_Caps_Reference (22 pins), PROC010B_PMIC_Reference (20 pins), PROC010B_LC_Filtering_Reference (6 pins), PROC010B_SOP_Headers_Reference (R88.1 R96.1 R114.1), PROC010B_QSPI_Flash_Reference (C1.1 C2.1 U1.4 U1.9), PROC010B_Pwr_RST_LEDs (14 pins), PROC010B_LDO (23 pins), PROC010B_HD Connector (14 pins), PROC010B_LP Connector (7 pins), PROC010B_XDS110 Interface_1A (22 pins), PROC010B_XDS110 Interface_1B (21 pins), PROC010B_CAN Interface (10 pins), PROC010B_Tempsensor (5 pins)
MCU_3V3: PROC010B_Pwr_RST_LEDs (R130.1), PROC010B_LP Connector (J4.3 J5.1)
PMIC_1V0: PROC010B_PMIC_Reference (C81.2 L4.2 U8.1), PROC010B_LC_Filtering_Reference (L5.1 L8.1), PROC010B_LDO (10 pins)
PMIC_1V2: PROC010B_PMIC_Reference (C54.2 L1.2 U8.14), PROC010B_LC_Filtering_Reference (L9.1)
PMIC_1V8: PROC010B_PMIC_Reference (C82.2 L3.2 U8.21), PROC010B_LC_Filtering_Reference (L7.1), PROC010B_LDO (6 pins)
PMICOUT_3V3: PROC010B_PMIC_Reference (C55.2 L2.2 R141.1 U8.8), PROC010B_Pwr_RST_LEDs (R133.1)
VDDC_1: PROC010B_XDS110 Interface_1A (C62.2 C64.2 C74.2 C75.2), PROC010B_XDS110 Interface_1B (U6.87 U6.115)
XDSET_1_VBUS: PROC010B_XDS110 Interface_1A (R151.2 R161.2 U10.6), PROC010B_XDS110 Interface_1B (R154.2)
AR_ANAMUX: PROC010B_DUT_Reference (U2.C13), PROC010B_LP Connector (P1.3)
AR_ANATEST1: PROC010B_DUT_Reference (U2.P1), PROC010B_LP Connector (R104.2)
AR_ANATEST2: PROC010B_DUT_Reference (U2.P2), PROC010B_LP Connector (R94.2)
AR_ANATEST3: PROC010B_DUT_Reference (U2.P3), PROC010B_LP Connector (R105.2)
AR_ANATEST4: PROC010B_DUT_Reference (U2.R2), PROC010B_LP Connector (R106.2)
AR_BSS_LOGGER: PROC010B_DUT_Reference (U2.R4), PROC010B_LP Connector (R31.1), PROC010B_XDS110 Interface_1B (R135.1)
AR_CS1: PROC010B_DUT_Reference (U2.R7), PROC010B_CAN Interface (U13.10)
AR_GPIO_0: PROC010B_DUT_Reference (U2.N4), PROC010B_LP Connector (R164.1), PROC010B_CAN Interface (R177.2)
AR_GPIO_1: PROC010B_DUT_Reference (U2.N7), PROC010B_Pwr_RST_LEDs (R72.2), PROC010B_LP Connector (R9.2)
AR_GPIO_2: PROC010B_DUT_Reference (U2.N13), PROC010B_Pwr_RST_LEDs (R110.2 R116.1), PROC010B_LP Connector (R8.2)
AR_HOSTINTR1: PROC010B_DUT_Reference (R13.2 U2.P6), PROC010B_HD Connector (R64.2), PROC010B_LP Connector (R10.2)
AR_LVDS_VALID_N: PROC010B_DUT_Reference (U2.N14), PROC010B_HD Connector (R60.2)
AR_LVDS_VALID_P: PROC010B_DUT_Reference (U2.N15), PROC010B_HD Connector (R61.2)
AR_LVDSCSI0_N: PROC010B_DUT_Reference (U2.G14), PROC010B_HD Connector (R48.2)
AR_LVDSCSI0_P: PROC010B_DUT_Reference (U2.G15), PROC010B_HD Connector (R49.2)
AR_LVDSCSI1_N: PROC010B_DUT_Reference (U2.H14), PROC010B_HD Connector (R50.2)
AR_LVDSCSI1_P: PROC010B_DUT_Reference (U2.H15), PROC010B_HD Connector (R51.2)
AR_LVDSCSI2_N: PROC010B_DUT_Reference (U2.K14), PROC010B_HD Connector (R54.2)
AR_LVDSCSI2_P: PROC010B_DUT_Reference (U2.K15), PROC010B_HD Connector (R55.2)
AR_LVDSCSI3_N: PROC010B_DUT_Reference (U2.L14), PROC010B_HD Connector (R56.2)
AR_LVDSCSI3_P: PROC010B_DUT_Reference (U2.L15), PROC010B_HD Connector (R57.2)
AR_LVDSCSI_CLK_N: PROC010B_DUT_Reference (U2.J14), PROC010B_HD Connector (R52.2)
AR_LVDSCSI_CLK_P: PROC010B_DUT_Reference (U2.J15), PROC010B_HD Connector (R53.2)
AR_LVDSCSI_FRCLK_N: PROC010B_DUT_Reference (U2.M14), PROC010B_HD Connector (R58.2)
AR_LVDSCSI_FRCLK_P: PROC010B_DUT_Reference (U2.M15), PROC010B_HD Connector (R59.2)
AR_MCUCLKOUT: PROC010B_DUT_Reference (U2.N9), PROC010B_LP Connector (R25.1)
AR_MISO1: PROC010B_DUT_Reference (U2.P5), PROC010B_CAN Interface (U13.2)
AR_MOSI1: PROC010B_DUT_Reference (U2.R8), PROC010B_CAN Interface (U13.5)
AR_MSS_LOGGER: PROC010B_DUT_Reference (U2.R5), PROC010B_LP Connector (R26.1), PROC010B_XDS110 Interface_1B (R136.1)
AR_NERR_OUT: PROC010B_DUT_Reference (R91.1 U2.N8), PROC010B_Pwr_RST_LEDs (DS1.2), PROC010B_HD Connector (R7.2), PROC010B_LP Connector (R19.1)
AR_NERRIN: PROC010B_DUT_Reference (R16.1 U2.P7), PROC010B_LP Connector (R24.1)
AR_NRST: PROC010B_DUT_Reference (U2.P12), PROC010B_Pwr_RST_LEDs (6 pins)
AR_NRST_MCU: PROC010B_Pwr_RST_LEDs (R77.1), PROC010B_HD Connector (R20.1), PROC010B_LP Connector (R2.2)
AR_NRST_XDS: PROC010B_Pwr_RST_LEDs (R80.1), PROC010B_XDS110 Interface_1B (U6.40)
AR_OSC_CLKOUT: PROC010B_DUT_Reference (U2.A14), PROC010B_HD Connector (R111.1)
AR_PMIC_CLKOUT_SOP2: PROC010B_DUT_Reference (U2.P13), PROC010B_SOP_Headers_Reference (R97.1 R98.1), PROC010B_LP Connector (R109.2)
AR_QSPI_CS: PROC010B_DUT_Reference (U2.P8), PROC010B_QSPI_Flash_Reference (R38.1 U1.1)
AR_QSPI_D0: PROC010B_DUT_Reference (U2.R11), PROC010B_QSPI_Flash_Reference (R45.2)
AR_QSPI_D1: PROC010B_DUT_Reference (U2.P9), PROC010B_QSPI_Flash_Reference (R39.1)
AR_QSPI_D2: PROC010B_DUT_Reference (U2.R12), PROC010B_QSPI_Flash_Reference (R42.1 R43.1)
AR_QSPI_D3: PROC010B_DUT_Reference (U2.P10), PROC010B_QSPI_Flash_Reference (R40.2 R41.1)
AR_QSPI_SCLK: PROC010B_DUT_Reference (U2.R10), PROC010B_QSPI_Flash_Reference (R44.2)
AR_RS232RX: PROC010B_DUT_Reference (U2.N5), PROC010B_HD Connector (R33.1), PROC010B_LP Connector (R166.1 R168.1 R172.1), PROC010B_XDS110 Interface_1B (R129.1)
AR_RS232TX: PROC010B_DUT_Reference (U2.N6), PROC010B_HD Connector (R21.1), PROC010B_LP Connector (R167.1 R169.1 R173.1), PROC010B_XDS110 Interface_1B (R128.1)
AR_SCL: PROC010B_DUT_Reference (R171.1 R197.1), PROC010B_PMIC_Reference (R144.1), PROC010B_HD Connector (R22.1), PROC010B_LP Connector (R163.1), PROC010B_Tempsensor (R180.1 R185.1)
AR_SDA: PROC010B_DUT_Reference (R170.1 R198.1), PROC010B_PMIC_Reference (R146.2), PROC010B_HD Connector (R23.1), PROC010B_LP Connector (R162.1), PROC010B_Tempsensor (R182.2 R186.2)
AR_SPICLK1: PROC010B_DUT_Reference (U2.R9), PROC010B_CAN Interface (U13.7)
AR_SYNC_IN: PROC010B_DUT_Reference (R196.2 U2.N10), PROC010B_HD Connector (R62.2), PROC010B_LP Connector (R165.1)
AR_SYNC_OUT_SOP1: PROC010B_DUT_Reference (U2.P11), PROC010B_SOP_Headers_Reference (R113.1), PROC010B_LP Connector (R108.2)
AR_TCK: PROC010B_DUT_Reference (U2.M13), PROC010B_HD Connector (R66.2 R70.1)
AR_TDI: PROC010B_DUT_Reference (U2.H13), PROC010B_HD Connector (R29.1 R30.1)
AR_TDO_SOP0: PROC010B_DUT_Reference (U2.J13), PROC010B_SOP_Headers_Reference (R89.1), PROC010B_HD Connector (R67.2 R71.1)
AR_TMS: PROC010B_DUT_Reference (U2.L13), PROC010B_HD Connector (R65.2 R69.1)
AR_VSENSE: PROC010B_DUT_Reference (U2.C14), PROC010B_LP Connector (P1.1)
AR_WARMRST: PROC010B_DUT_Reference (R15.1 U2.N12), PROC010B_Pwr_RST_LEDs (DS5.2), PROC010B_LP Connector (R18.1)
CS1: PROC010B_DUT_Reference (R14.1), PROC010B_HD Connector (R17.1), PROC010B_LP Connector (R1.2), PROC010B_CAN Interface (U13.11)
MCU_SOP0: PROC010B_SOP_Headers_Reference (R93.2), PROC010B_LP Connector (R36.1)
MCU_SOP1: PROC010B_SOP_Headers_Reference (R112.2), PROC010B_LP Connector (R35.1)
MCU_SOP2: PROC010B_SOP_Headers_Reference (R101.2), PROC010B_LP Connector (R32.1)
MISO1: PROC010B_HD Connector (R63.2), PROC010B_LP Connector (R3.2 R6.2), PROC010B_CAN Interface (U13.1)
MOSI1: PROC010B_HD Connector (R28.1), PROC010B_LP Connector (R4.2 R5.2), PROC010B_CAN Interface (U13.4)
PGOOD: PROC010B_PMIC_Reference (R138.2 R141.2), PROC010B_HD Connector (R27.1), PROC010B_LP Connector (R107.2), PROC010B_XDS110 Interface_1A (R159.1)
PMIC_CLK: PROC010B_PMIC_Reference (U8.3), PROC010B_SOP_Headers_Reference (R97.2)
PMIC_EN1: PROC010B_PMIC_Reference (R142.1 U8.7), PROC010B_LP Connector (R102.2)
SPICLK1: PROC010B_HD Connector (R75.1), PROC010B_LP Connector (R76.1), PROC010B_CAN Interface (U13.8)
VBUS_1_DETECT: PROC010B_XDS110 Interface_1A (C69.2 R151.1 R153.2), PROC010B_XDS110 Interface_1B (U6.1)
XDSET_1_D_N: PROC010B_XDS110 Interface_1A (J8.2 U10.1), PROC010B_XDS110 Interface_1B (U6.93)
XDSET_1_D_P: PROC010B_XDS110 Interface_1A (J8.3 U10.4), PROC010B_XDS110 Interface_1B (U6.94)
XDSET_1_ID: PROC010B_XDS110 Interface_1A (J8.4 U10.2), PROC010B_XDS110 Interface_1B (R152.2)
XDSET_TCK: PROC010B_HD Connector (R70.2), PROC010B_XDS110 Interface_1B (U6.35)
XDSET_TDI: PROC010B_HD Connector (R30.2), PROC010B_XDS110 Interface_1B (U6.38)
XDSET_TDO: PROC010B_HD Connector (R71.2), PROC010B_XDS110 Interface_1B (U6.37)
XDSET_TMS: PROC010B_HD Connector (R69.2), PROC010B_XDS110 Interface_1B (U6.36)

## Assembly variants
001: not fitted C8 C18 C21 C22 C23 C25 C28 C29 C30 C31 C32 C35 C37 C40 C44 C46 C83 FB2 FID1 FID2 FID3 FID4 FID5 FID6 FID7 R3 R5 R8 R9 R21 R26 R33 R46 R47 R81 R82 R83 R84 R97 R102 R108 R109 R115 R119 R120 R121 R122 R130 R131 R132 R135 R164 R166 R167 R168 R169 R177 R178 R197 R198 TP1 TP2 U4 U5
002: not fitted C8 C18 C21 C22 C23 C25 C28 C29 C30 C31 C32 C35 C37 C40 C44 C46 C83 FB2 FID1 FID2 FID3 FID4 FID5 FID6 FID7 R3 R5 R8 R9 R21 R26 R33 R46 R47 R81 R82 R83 R84 R97 R102 R108 R109 R115 R119 R120 R121 R122 R130 R131 R132 R135 R164 R166 R167 R168 R169 R177 R178 R197 R198 TP1 TP2 U4 U5
003: not fitted C8 C18 C21 C22 C23 C25 C28 C29 C30 C31 C32 C35 C37 C40 C44 C46 C83 FB2 FID1 FID2 FID3 FID4 FID5 FID6 FID7 R3 R5 R8 R9 R21 R26 R33 R46 R47 R81 R82 R83 R84 R97 R102 R108 R109 R115 R119 R120 R121 R122 R130 R131 R132 R135 R164 R166 R167 R168 R169 R177 R178 R197 R198 TP1 TP2 U4 U5
004: not fitted C8 C18 C21 C22 C23 C25 C28 C29 C30 C31 C32 C35 C37 C40 C44 C46 C83 FB2 FID1 FID2 FID3 FID4 FID5 FID6 FID7 R3 R5 R8 R9 R21 R26 R33 R46 R47 R81 R82 R83 R84 R97 R102 R108 R109 R115 R119 R120 R121 R122 R130 R131 R132 R135 R164 R166 R167 R168 R169 R177 R178 R197 R198 TP1 TP2 U4 U5; alternate parts U2 -> CMP-0082537-1